# EAGLE design Bankomart (EAGLE 7.2.0)
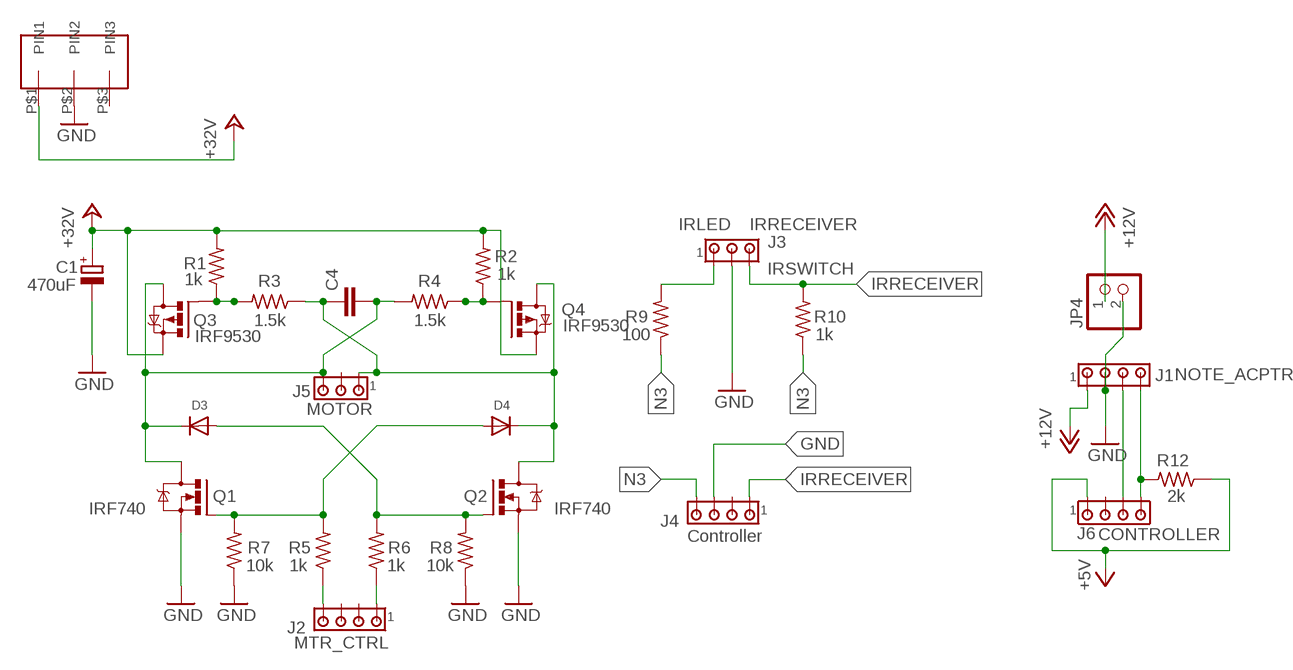
[diagram p0: schematic, sheet 1]

## Parts
C1  470uF  CPOL-EUE7.5-18  [E7,5-18]
C4  C-EU050-025X075  [C050-025X075]
D3  DIODEDO-1N4148  [DO-1N4148]
D4  DIODEDO-1N4148  [DO-1N4148]
J1  NOTE_ACPTR  MTA04-100  [10X04MTA]
J2  MTR_CTRL  MTA04-100  [10X04MTA]
J3  IRSWITCH  MTA03-100  [10X03MTA]
J4  Controller  MTA04-100  [10X04MTA]
J5  MOTOR  MTA03-100  [10X03MTA]
J6  CONTROLLER  MTA04-100  [10X04MTA]
JP4  PINHD-1X2  [1X02]
Q1  IRF740  [TO220BV]
Q2  IRF740  [TO220BV]
Q3  IRF9530  [TO220BV]
Q4  IRF9530  [TO220BV]
R1  1k  R-US_0207/10  [0207/10]
R2  1k  R-US_0207/10  [0207/10]
R3  1.5k  R-US_0207/10  [0207/10]
R4  1.5k  R-US_0207/10  [0207/10]
R5  1k  R-US_0207/10  [0207/10]
R6  1k  R-US_0207/10  [0207/10]
R7  10k  R-US_0207/10  [0207/10]
R8  10k  R-US_0207/10  [0207/10]
R9  100  R-US_0207/10  [0207/10]
R10  1k  R-US_0207/10  [0207/10]
R12  2k  R-US_0207/10  [0207/10]
U$1  CUSTOM-PIN-3  [CUSTOM-PIN-3]

## Nets
+5V: J6.1 R12.1
+12V: J1.1 JP4.1
+24V: C1.+ Q3.S Q4.S R1.2 R2.2 U$1.P$1(PIN1) ; supply symbol labelled +32V
GND: C1.- J1.2 J3.2 J4.3 JP4.2 Q1.S Q2.S R7.1 R8.1 U$1.P$2(PIN2)
IRLED: J3.1 R9.2
IRRECEIVER: J3.3 J4.1 R10.2
MOTOR_B: J2.1 R6.1
MOTOR_F: J2.4 R5.1
N3: J4.4 R9.1 R10.1
N$1: Q3.G R1.1 R3.2
N$2: C4.1 D4.C J5.1 Q2.D Q4.D R3.1
N$3: C4.2 D3.C J5.3 Q1.D Q3.D R4.2
N$4: Q4.G R2.1 R4.1
N$6: D3.A Q2.G R6.2 R8.2
N$8: D4.A Q1.G R5.2 R7.2
N$9: J1.3 J6.3
N$10: J1.4 J6.4 R12.2
Unconnected: J2.2 J2.3 J4.2 J5.2 J6.2 U$1.P$3(PIN3)

## Library data of the parts
C1 = rcl:CPOL-EU: POLARIZED CAPACITOR, European symbol
C4 = rcl:C-EU: CAPACITOR, European symbol
D3 D4 = adafruit:DIODE: Diode SMADIODE - SMA Surface Mount Package 20V 1A Schottky Diode Digikey: 641-1014-6-ND DO-1N4148 - Through Hole Small Current Diode SOD-123 20V 1 A (.5mV Vf) Schottky Diode - Digikey: MBRX120TPMSCT-ND SOD-323 10V 570mA (.38mV Vf, 3ns) Schottky Diode - Digikey: ZLLS410CT-ND SOD-523 30V 30mA Schottky Diode (RB751S-40TE61) - Digikey: RB751S-40TE61CT-ND SOT23-R/W - SOT23 Package (R = Solder Paste/Reflow Ovens, W = Hand-Soldering) BAT54Film 40V 300mA - Digikey: 497-7162-1-ND
J1 J2 J4 J6 = con-amp:MTA04-100: AMP connector
J3 J5 = con-amp:MTA03-100: AMP connector
JP4 = pinhead:PINHD-1X2: PIN HEADER
Q1 Q2 = transistor-power:IRF740: N-CHANNEL MOS FET
Q3 Q4 = transistor-power:IRF9530: P-CHANNEL HEXFET POWER-MOS-FET Source: http://www.irf.com/product-info/datasheets/data/irf9530.pdf
R1-R10 R12 = adafruit:R-US_: RESISTOR, American symbol
U$1 = pin-custom:CUSTOM-PIN-3

## Board
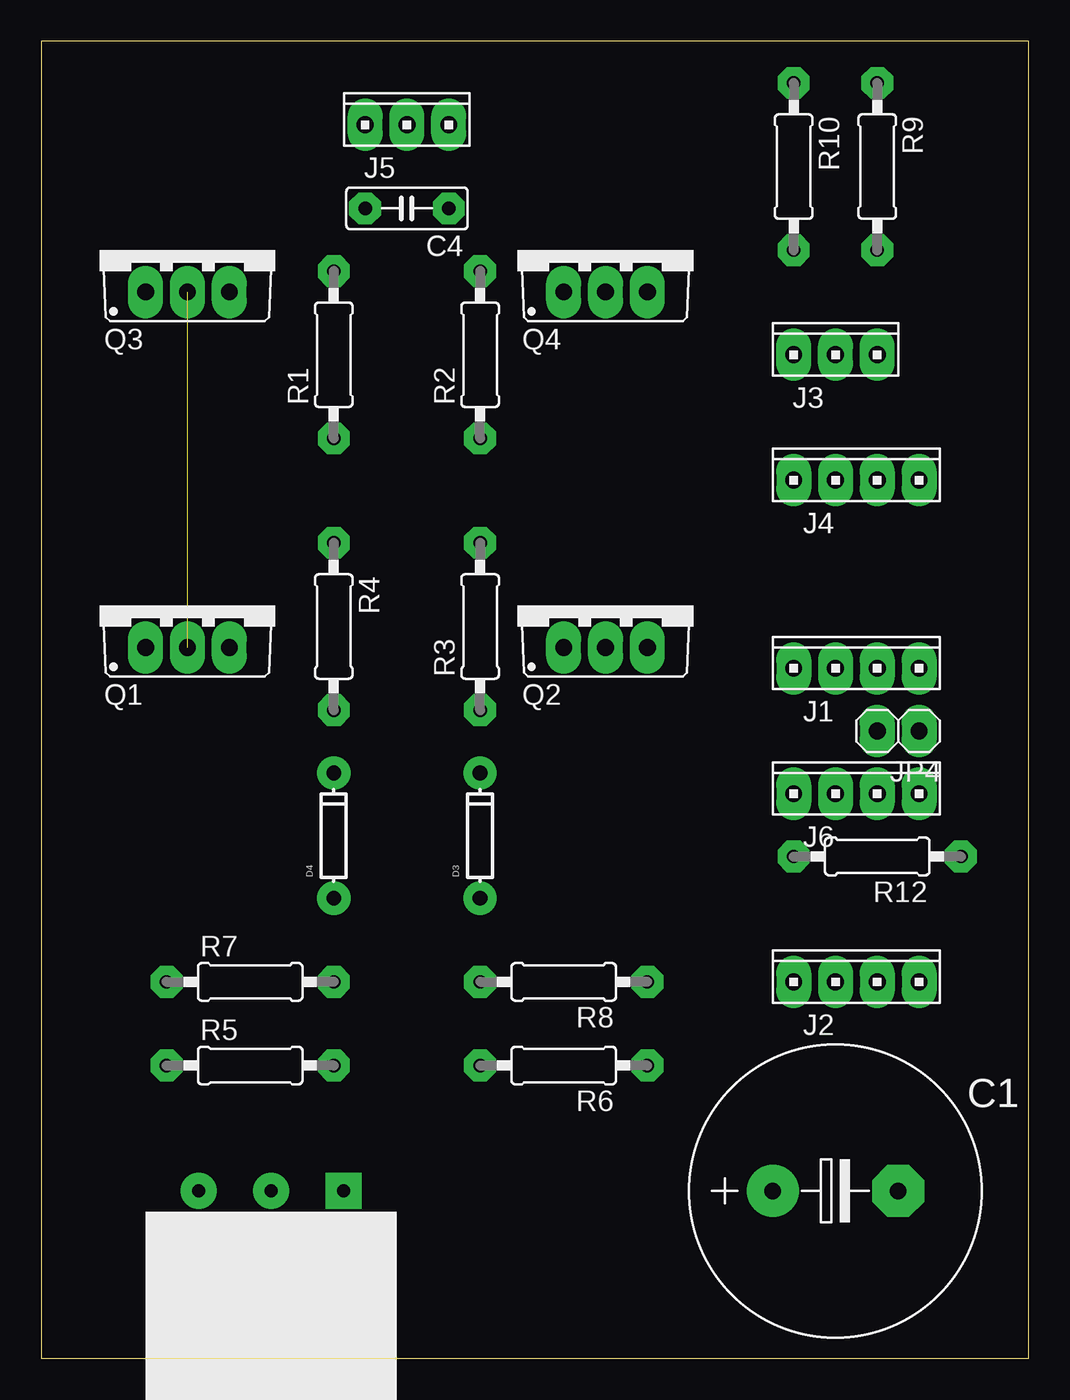
[diagram p1: board, top side]
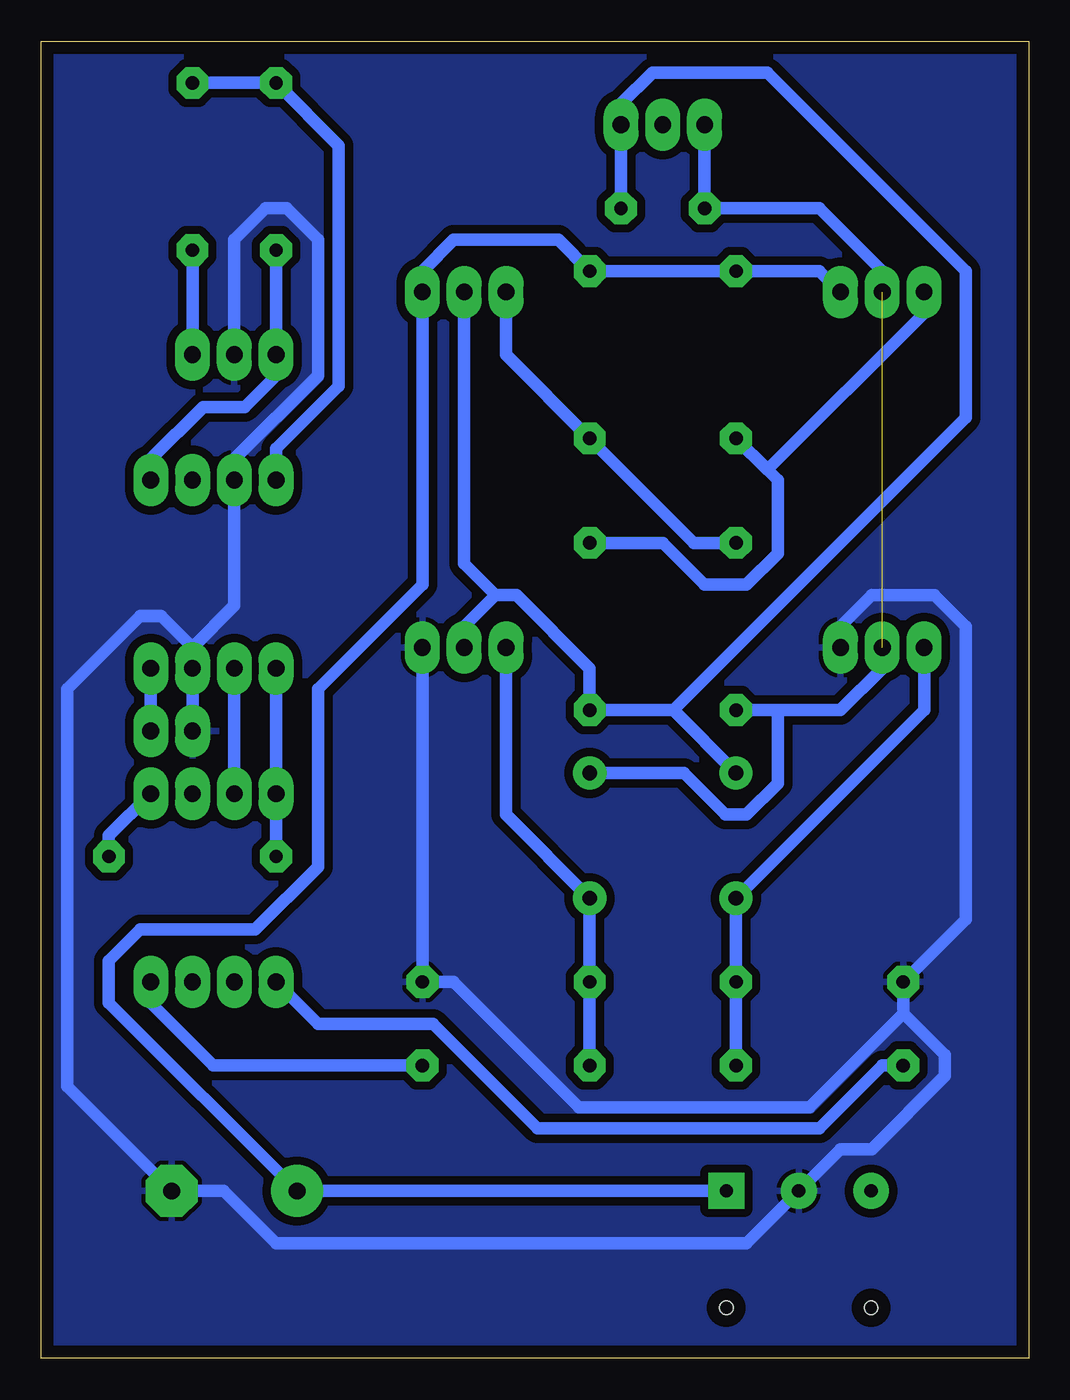
[diagram p2: board, bottom side, seen from below]

Size 59.99 x 80.02 mm. Coordinates in mm from the lower left corner, seen from the top.
Outline: 0,0.01 59.99,0.01 59.99,80.01 0,80.02 0,0
Copper layers (1*16): Top 0.035mm / dielectric 1.5mm / Bottom 0.035mm
Design rules "default *": minimum track width 30mil, minimum drill 15mil, track to track 20mil, track to pad 30mil, pad to pad 8mil, via to via 8mil, smd to smd 8mil, copper to edge 30mil, drill to drill 8mil, minimum pad ring 22mil, minimum via ring 8mil, stop-mask expansion 4mil, vias tented up to drill 0mil, thermal gap 10mil

### Footprints (pad centres in the part's own frame; a part is rotated, then mirrored left to right if it is on the bottom)
E7,5-18 = drill 1.016 pad 3.15: + -3.81,0 | drill 1.016 pad 3.15 octagon: - 3.81,0
C050-025X075 = drill 0.813 octagon: 1 -2.54,0; 2 2.54,0
DO-1N4148 = drill 0.9: A -3.81,0; C 3.81,0
10X04MTA = drill 1.016 long: 1 3.81,0; 2 1.27,0; 3 -1.27,0; 4 -3.81,0
10X03MTA = drill 1.016 long: 1 2.54,0; 2 0,0; 3 -2.54,0
1X02 = drill 1.016 long: 1 -1.27,0; 2 1.27,0
TO220BV = drill 1.016 long: D 0,-2.54; G -2.54,-2.54; S 2.54,-2.54
0207/10 = drill 0.813 octagon: 1 -5.08,0; 2 5.08,0
CUSTOM-PIN-3 = drill 0.8 pad 2.184 square: P$1 -4.4,0 | drill 0.8 pad 2.184: P$2 0,0; P$3 4.4,0 | hole 0.8: -4.4,7.1; 4.4,7.1

### Placement (x,y rotation side)
C1  48.26,10.17 0 top
C4  22.23,69.86 180 top
D3  26.67,31.76 90 top
D4  17.78,31.76 90 top
J1  49.53,41.92 0 top
J2  49.53,22.87 0 top
J3  48.26,60.97 0 top
J4  49.53,53.35 0 top
J5  22.23,74.94 0 top
J6  49.53,34.3 0 top
JP4  52.07,38.11 180 top
Q1  8.89,45.73 0 top
Q2  34.29,45.73 0 top
Q3  8.89,67.32 0 top
Q4  34.29,67.32 0 top
R1  17.78,60.97 90 top
R2  26.67,60.97 90 top
R3  26.67,44.46 90 top
R4  17.78,44.46 270 top
R5  12.7,17.79 0 top
R6  31.75,17.79 180 top
R7  12.7,22.87 0 top
R8  31.75,22.87 180 top
R9  50.8,72.4 270 top
R10  45.72,72.4 270 top
R12  50.8,30.49 180 top
U$1  13.97,10.17 180 top

### Tracks (layer width: path | path; a pad name or v marks a point on that pad's centre or on a via)
+5V
  Bottom 0.762: R12.1 55.88,31.76 J6.1
+12V
  Bottom 0.762: J1.1 JP4.1
+24V
  Bottom 0.762: Q3.S 12.7,66.05 R1.2 R2.2 28.58,67.95 34.92,67.95 36.83,66.05 Q4.S 36.83,47 43.18,40.65 43.18,29.86 46.99,26.05 53.98,26.05 55.88,24.14 55.88,21.6 C1.+ U$1.P$1
GND
  Bottom 0.762: JP4.2 J1.2 50.8,43.19 | 50.8,43.19 48.26,45.73 J4.3 48.26,54.62 43.18,59.7 43.18,67.95 45.09,69.86 46.35,69.86 48.26,67.95 J3.2 | Q2.S R8.1 34.92,22.87 27.3,15.25 13.34,15.25 7.62,20.96 | 7.62,20.96 R7.1 3.81,26.68 3.81,44.46 5.71,46.36 9.52,46.36 11.43,44.46 Q1.S | 7.62,20.96 5.08,18.43 5.08,17.16 9.52,12.71 11.43,12.71 U$1.P$2 17.14,7 45.72,7 48.9,10.17 C1.- 58.42,16.52 58.42,40.65 53.98,45.09 52.71,45.09 50.8,43.19
  pour Bottom: 0,80.02 0,0.01 59.69,0.01 59.69,80.02
IRLED
  Bottom 0.762: J3.1 R9.2
IRRECEIVER
  Bottom 0.762: R10.2 J3.3 45.72,59.7 47.62,57.79 50.16,57.79 53.34,54.62 J4.1
MOTOR_B
  Bottom 0.762: R6.1 49.53,17.79 53.34,21.6 J2.1
MOTOR_F
  Bottom 0.762: R5.1 8.89,17.79 12.7,13.98 29.84,13.98 36.2,20.33 43.18,20.33 J2.4
N3
  Bottom 0.762: R9.1 R10.1 41.91,73.67 41.91,59.06 45.72,55.25 J4.4
N$1
  Bottom 0.762: R3.2 22.23,49.54 19.68,47 17.14,47 15.24,48.91 15.24,53.35 15.88,53.98 | R1.1 15.88,53.98 | Q3.G 6.35,63.51 15.88,53.98
N$2
  Bottom 0.762: C4.1 J5.1 24.77,76.21 22.86,78.12 15.88,78.12 3.81,66.05 3.81,57.16 21.59,39.38 | 21.59,39.38 R3.1 26.67,41.92 31.12,46.36 32.38,46.36 | D4.C 21.59,39.38 | Q2.D 34.29,44.46 32.38,46.36 | Q4.D 34.29,48.27 32.38,46.36
N$3  (1 unrouted)
  Bottom 0.762: 15.24,39.38 11.43,39.38 8.89,41.92 Q1.D | 15.24,39.38 R4.2 | D3.C 20.95,35.57 18.41,33.03 17.14,33.03 15.24,34.93 15.24,39.38 | J5.3 C4.2 12.7,69.86 8.89,66.05 Q3.D
N$4
  Bottom 0.762: R4.1 20.32,49.54 R2.1 31.75,60.97 Q4.G
N$6
  Bottom 0.762: R6.2 R8.2 D3.A 31.75,33.03 Q2.G
N$8
  Bottom 0.762: R5.2 R7.2 D4.A 6.35,39.38 Q1.G
N$9
  Bottom 0.762: J1.3 J6.3
N$10
  Bottom 0.762: R12.2 J6.4 J1.4

### Text on the board
tDocu: +32V | GND | +12V | +5V | +32V